# Altium project FOC-PMSM.PrjPcb
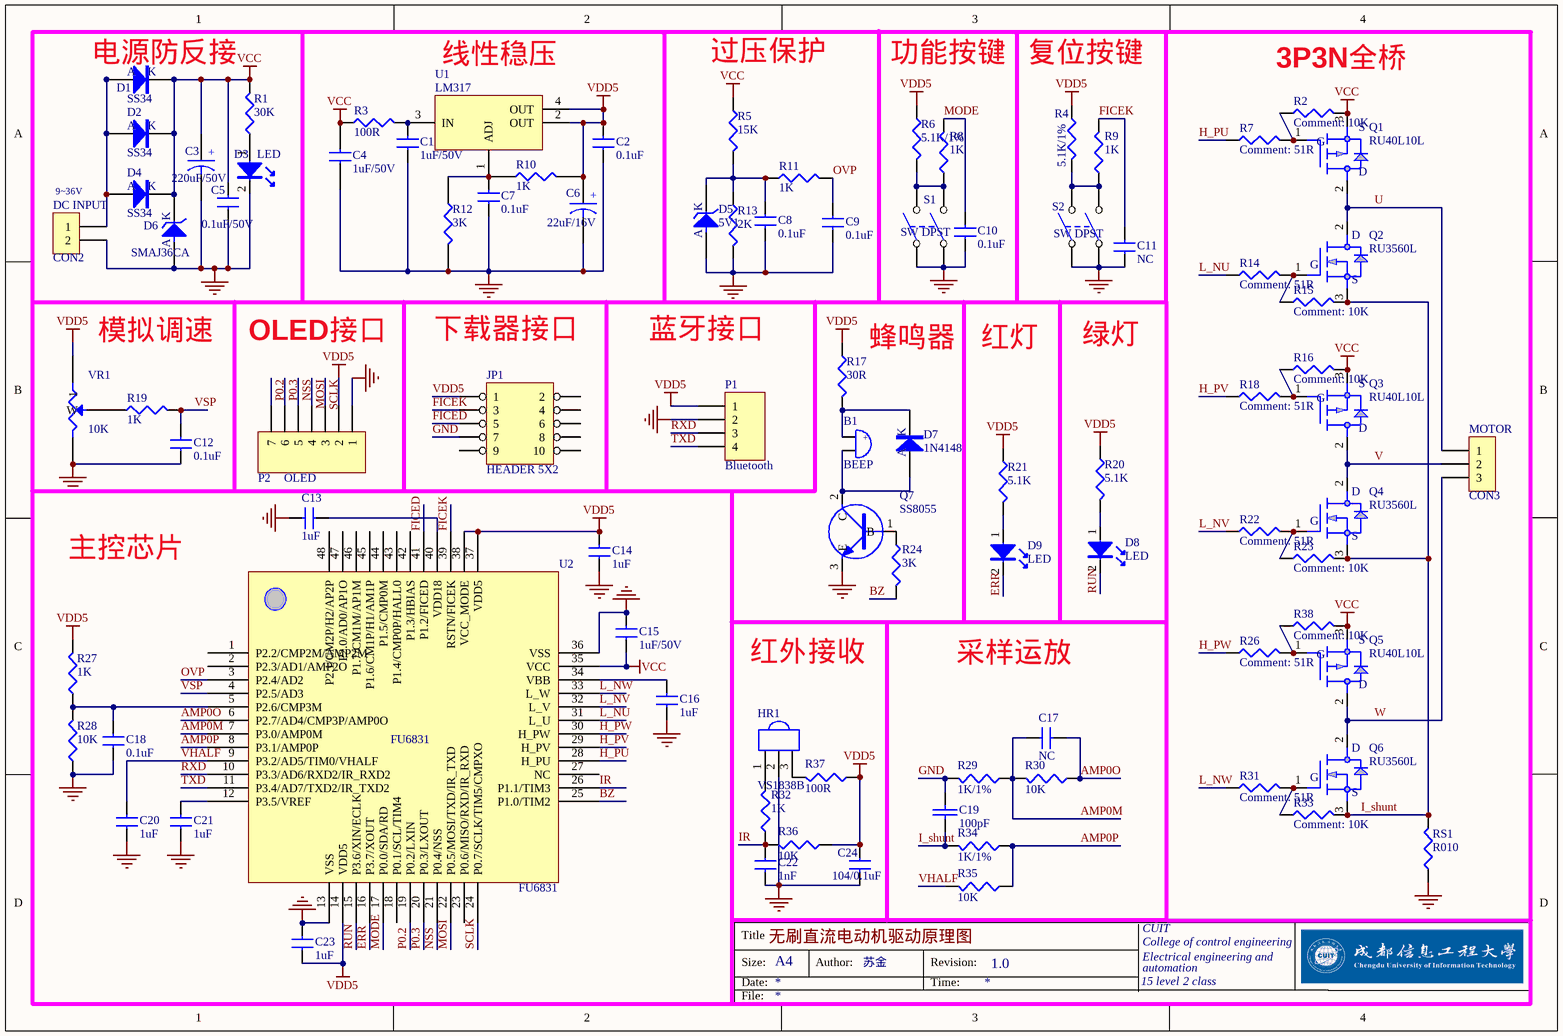
[diagram p0: FOC-PMSM.SchDoc]
1 sheet, 90 parts. Net scope: global (net labels, ports and power ports of the same name join across sheets).
Board file: FOC-PMSM.PcbDoc

## Sheet FOC-PMSM.SchDoc: 无刷直流电动机驱动原理图
size A4; Author: 苏金; Organization: Altium Limited; Address1: L3, 12a Rodborough Rd; Address2: Frenchs Forest; Address3: NSW; Address4: Australia 2086; Revision: 1.0

### Parts
B1  BEEP  [BEEP 7.6x12x9.5]
C1  1uF/50V  [C0805]
C2  0.1uF  [C0805]
C3  220uF/50V  [CE5-10/16]
C4  1uF/50V  [C0805]
C5  0.1uF/50V  [C0805]
C6  22uF/16V  [DIP-EC2.0X5X11]
C7  0.1uF  [C0805]
C8  0.1uF  [C0805]
C9  0.1uF  [C0805]
C10  0.1uF  [C0805]
C11  NC  [C0805]
C12  0.1uF  [C0805]
C13  1uF  [C0805]
C14  1uF  [C0805]
C15  1uF/50V  [C0805]
C16  1uF  [C0805]
C17  NC  [C0805]
C18  0.1uF  [C0805]
C19  100pF  [C0805]
C20  1uF  [C0805]
C21  1uF  [C0805]
C22  1nF  [C0805]
C23  1uF  [C0805]
C24  104/0.1uF  [C0805]
D1  SS34  [SMB]
D2  SS34  [SMB]
D3  LED  [LED0805]
D4  SS34  [SMB]
D5  5V1  [SOD-123]
D6  SMAJ36CA  [SMA]
D7  1N4148  [SOD-123]
D8  LED  [LED0805]
D9  LED  [LED0805]
DC_INPUT  CON2  [250-2P]
HR1  VS1838B  [VS1838B-B_H]
JP1  HEADER 5X2  [DC3-14P 2*7  2.54]
MOTOR  CON3  [250-3P]
P1  Bluetooth  [HDR1X4]
P2  OLED  [HDR1X7]
Q1  RU40L10L  [TO-252-3L]
Q2  RU3560L  [TO-252-3L]
Q3  RU40L10L  [TO-252-3L]
Q4  RU3560L  [TO-252-3L]
Q5  RU40L10L  [TO-252-3L]
Q6  RU3560L  [TO-252-3L]
Q7  SS8055  [SOT-23]
R1  30K  [R0805]
R2  10K  [R0805]
R3  100R  [R2512]
R4  5.1K/1%  [R0805]
R5  15K  [R0805]
R6  5.1K/1%  [R0805]
R7  51R  [R0805]
R8  1K  [R0805]
R9  1K  [R0805]
R10  1K  [R0805]
R11  1K  [R0805]
R12  3K  [R0805]
R13  2K  [R0805]
R14  51R  [R0805]
R15  10K  [R0805]
R16  10K  [R0805]
R17  30R  [R0805]
R18  51R  [R0805]
R19  1K  [R0805]
R20  5.1K  [R0805]
R21  5.1K  [R0805]
R22  51R  [R0805]
R23  10K  [R0805]
R24  3K  [R0805]
R26  51R  [R0805]
R27  1K  [R0805]
R28  10K  [R0805]
R29  1K/1%  [R0805]
R30  10K  [R0805]
R31  51R  [R0805]
R32  1K  [R0805]
R33  10K  [R0805]
R34  1K/1%  [R0805]
R35  10K  [R0805]
R36  10K  [R0805]
R37  100R  [R0805]
R38  10K  [R0805]
RS1  R010  [R2512]
S1  SW DPST  [SW-6/6]
S2  SW DPST  [SW-6/6]
U1  LM317  [SOT-223]
U2  FU6831  [LQFP48]
VR1  10K  [VR6]

### Nets
GND: C1.2 C2.2 C3.2 C4.2 C5.2 C6.2 C7.2 C8.2 C9.2 C10.2 C11.2 C12.2 C13.1 C14.2 C15.1 C16.2 C18.1 C19.1 C20.1 C21.1 C22.2 C23.1 C24.2 D3.2 D5.1(A) D6.1(A) DC_INPUT.2 HR1.2(K) JP1.7 P1.2 P2.1 Q7.3(E) R12.2 R13.2 R28.1 R29.2 RS1.1 S1.1(COMMON1) S2.1(COMMON1) U2.13(VSS) U2.36(VSS) VR1.3
VCC: C3.1 C4.1 C5.1 C15.2 D1.2(K) D2.2(K) D4.2(K) D6.2(K) Q1.3(S) Q3.3(S) Q5.3(S) R1.2 R2.2 R3.1 R5.1 R16.2 R38.2 U2.35(VCC)
VDD5: C2.1 C6.1 C14.1 C23.2 C24.1 JP1.1 P1.1 P2.2 R4.1 R6.1 R10.2 R17.1 R20.1 R21.1 R27.2 R36.1 R37.1 U1.2(OUT) U1.4(OUT) U2.14(VDD5) U2.37(VDD5) U2.38(VCC_MODE) VR1.1
AMP0M: C17.1 R29.1 R30.2 U2.7(P3.0/AMP0M)
AMP0O: C17.2 R30.1 U2.6(P2.7/AD4/CMP3P/AMP0O)
AMP0P: R34.1 R35.1 U2.8(P3.1/AMP0P)
BZ: R24.2 U2.25(P1.0/TIM2)
ERR: D9.2 U2.16(P3.7/XOUT)
FICED: JP1.5 U2.41(P1.2/FICED)
FICEK: C11.1 JP1.3 R9.2 U2.39(RSTN/FICEK)
H_PU: R7.1 U2.28(H_PU)
H_PV: R18.1 U2.29(H_PV)
H_PW: R26.1 U2.30(H_PW)
I_shunt: C19.2 Q2.3(S) Q4.3(S) Q6.3(S) R15.2 R23.2 R33.2 R34.2 RS1.2
IR: C22.1 R32.1 R36.2 U2.26(P1.1/TIM3)
L_NU: R14.1 U2.31(L_U)
L_NV: R22.1 U2.32(L_V)
L_NW: R31.1 U2.33(L_W)
MODE: C10.1 R8.2 U2.17(P0.0/SDA/RD)
MOSI: P2.4 U2.22(P0.5/MOSI/TXD/IR_TXD)
NSS: P2.5 U2.21(P0.4/NSS)
OVP: C9.1 R11.2 U2.3(P2.4/AD2)
P0.2: P2.7 U2.19(P0.2/LXIN)
P0.3: P2.6 U2.20(P0.3/LXOUT)
RUN: D8.2 U2.15(P3.6/XIN/ECLK)
RXD: P1.3 U2.10(P3.3/AD6/RXD2/IR_RXD2)
SCLK: P2.3 U2.24(P0.7/SCLK/TIM5/CMPXO)
TXD: P1.4 U2.11(P3.4/AD7/TXD2/IR_TXD2)
U: MOTOR.1 Q1.2(D) Q2.2(D)
V: MOTOR.2 Q3.2(D) Q4.2(D)
VHALF: C20.2 R35.2 U2.9(P3.2/AD5/TIM0/VHALF)
VSP: C12.1 R19.2 U2.4(P2.5/AD3)
W: MOTOR.3 Q5.2(D) Q6.2(D)
NetB1_1: B1.1 D7.2(K) R17.2
NetB1_2: B1.2 D7.1 Q7.2(C)
NetC1_1: C1.1 R3.2 U1.3(IN)
NetC7_1: C7.1 R10.1 R12.1 U1.1(ADJ)
NetC8_1: C8.1 D5.2(K) R5.2 R11.1 R13.1
NetC13_2: C13.2 U2.40(VDD18)
NetC16_1: C16.1 U2.34(VBB)
NetC18_2: C18.2 R27.1 R28.2 U2.5(P2.6/CMP3M)
NetC21_2: C21.2 U2.12(P3.5/VREF)
NetD1_1: D1.1 D2.1 D4.1 DC_INPUT.1
NetD3_1: D3.1 R1.1
NetD8_1: D8.1 R20.2
NetD9_1: D9.1 R21.2
NetHR1_1: HR1.1(A) R32.2
NetHR1_3: HR1.3(E) R37.2
NetQ1_1: Q1.1(G) R2.1 R7.2
NetQ2_1: Q2.1(G) R14.2 R15.1
NetQ3_1: Q3.1(G) R16.1 R18.2
NetQ4_1: Q4.1(G) R22.2 R23.1
NetQ5_1: Q5.1(G) R26.2 R38.1
NetQ6_1: Q6.1(G) R31.2 R33.1
NetQ7_1: Q7.1(B) R24.1
NetR4_2: R4.2 R9.1 S2.2(NO1)
NetR6_2: R6.2 R8.1 S1.2(NO1)
NetR19_1: R19.1 VR1.W

Not connected (* = marked no-connect by the designer): JP1 2 4 6 8 9 10; U2 1(P2.2/CMP2M/AMP2M) 2(P2.3/AD1/AMP2O) 18(P0.1/SCL/TIM4) 23(P0.6/MISO/RXD/IR_RXD) 27(NC) 42(P1.3/HBIAS) 43(P1.4/CMP0P/HALL0) 44(P1.5/CMP0M) 45(P1.6/CM1P/H1/AM1P) 46(P1.7/CM1M/AP1M) 47(P2.0/AD0/AP1O) 48(P2.1/CM2P/H2/AP2P)

### Notes on the sheet
- (near D1) 电源防反接
- (near U1) 线性稳压
- (near R5) 过压保护
- 功能按键
- 复位按键
- 3P3N全桥
- (near DC_INPUT) 9~36V
- (near VR1) 模拟调速
- OLED接口
- 下载器接口
- 蓝牙接口
- (near R17) 蜂鸣器
- 红灯
- 绿灯
- 主控芯片
- 红外接收
- 采样运放
- Title
- Size:
- Date:
- A4
- Author:
- Revision:
- Time:
- 15 level
- CUIT
- College of control engineering
- automation
- Electrical engineering and
- 2 class
- File:
- (in symbol BEEP) +
- (in symbol CAP极性) +
- (in symbol DIODE) A

### Library data of the parts
B1 = BEEP: 蜂鸣器
C1 C2 C4 C5 C7-C24 = CAP: Capacitor
C3 C6 = CAP极性: Capacitor
D1 D2 D4 D7 = DIODE
D5 D6 = ZENER3: Zener Diode
DC_INPUT = CON2: Connector
HR1 = VS1838B: 红外接收头
MOTOR = CON3: Connector
P1 = Header 4: Header, 4-Pin; LatestRevisionDate: 17-Jul-2002; LatestRevisionNote: Re-released for DXP Platform.; Publisher: Altium Limited
P2 = Header 7: Header, 7-Pin; LatestRevisionDate: 17-Jul-2002; LatestRevisionNote: Re-released for DXP Platform.; Publisher: Altium Limited
Q1 Q3 Q5 = CAP_4: Text Field1: 50; Text Field2: 40
Q2 Q4 Q6 = CAP_2: Text Field1: 50; Text Field2: 40
Q7 = NPN: NPN Transistor
R1-R3 R5 R7 R10-R18 R20-R24 R26-R28 R31-R33 R36-R38 RS1 = RES-SMD: RES
R4 R6 R8 R9 R19 R29 R30 R34 R35 = RES(SMD)
VR1 = RV-3296: Potentiometer